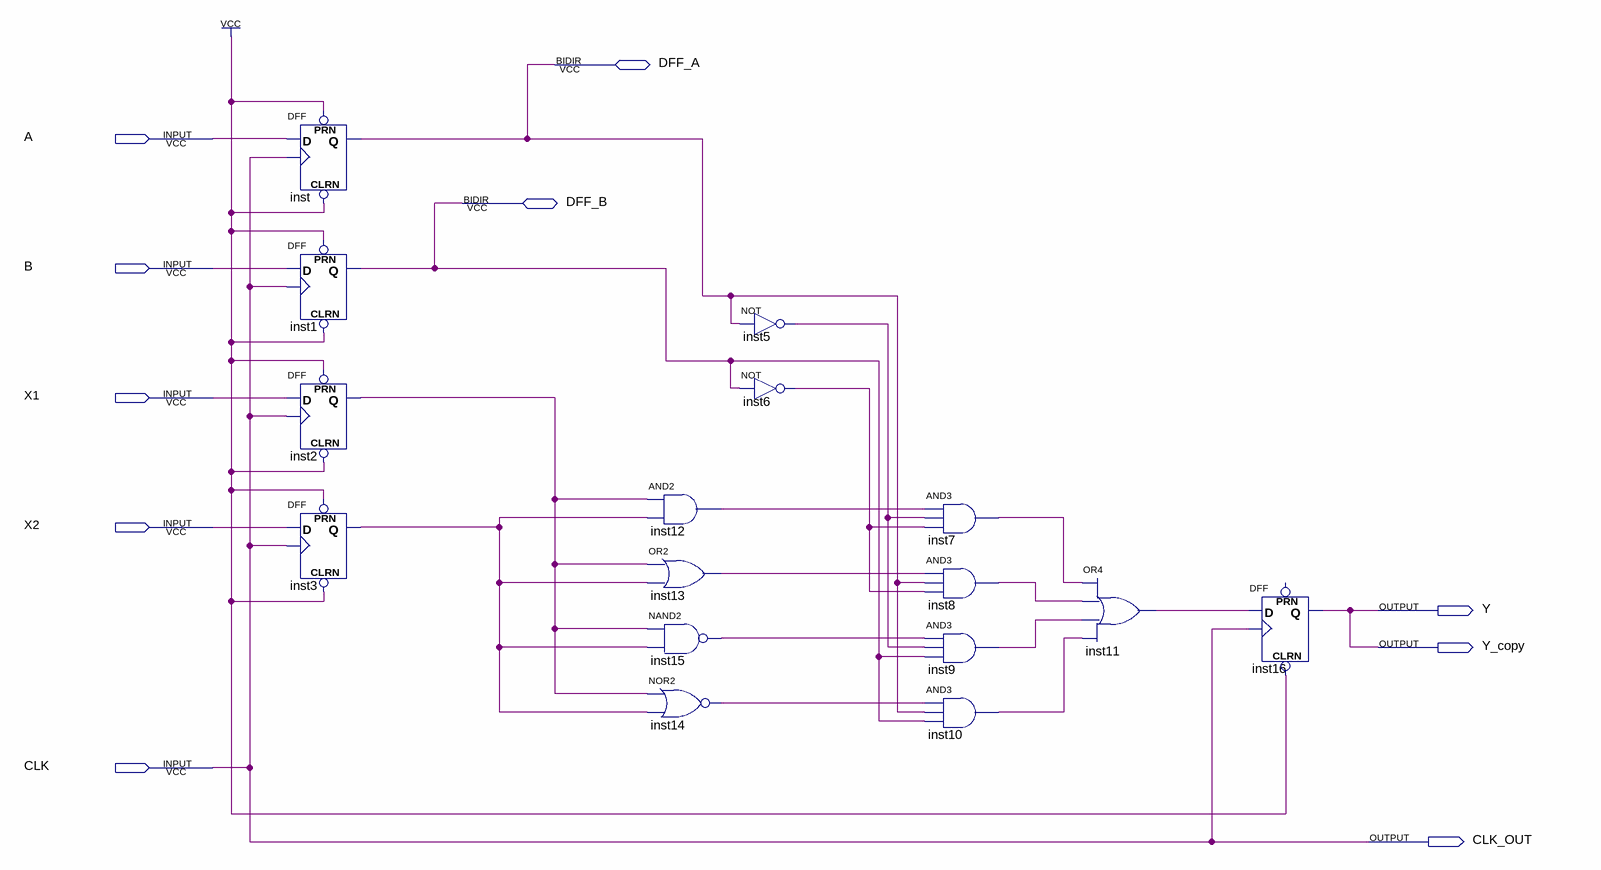
[diagram p0: schematic sheet]
// Quartus schematic fpga_1bit.bdf as structural Verilog: 16 symbols, 10 pins
module fpga_1bit (
  input  A,
  input  B,
  input  X1,
  input  X2,
  input  CLK,
  inout  DFF_A,
  inout  DFF_B,
  output Y,
  output Y_copy,
  output CLK_OUT
);

  wire inst2_q, inst3_q, inst5_out, inst6_out, inst7_out, inst8_out, inst9_out, inst10_out, inst11_out,
       inst12_out, inst13_out, inst14_out, inst15_out;

  DFF inst (.CLRN(1'b1), .CLK(CLK), .D(A), .PRN(1'b1), .Q(DFF_A));
  DFF inst1 (.CLRN(1'b1), .CLK(CLK), .D(B), .PRN(1'b1), .Q(DFF_B));
  DFF inst2 (.CLRN(1'b1), .CLK(CLK), .D(X1), .PRN(1'b1), .Q(inst2_q));
  DFF inst3 (.CLRN(1'b1), .CLK(CLK), .D(X2), .PRN(1'b1), .Q(inst3_q));
  and inst12 (inst12_out, inst2_q, inst3_q);
  or inst13 (inst13_out, inst2_q, inst3_q);
  nand inst15 (inst15_out, inst2_q, inst3_q);
  nor inst14 (inst14_out, inst2_q, inst3_q);
  not inst5 (inst5_out, DFF_A);
  not inst6 (inst6_out, DFF_B);
  and inst7 (inst7_out, inst12_out, inst5_out, inst6_out);
  and inst8 (inst8_out, inst13_out, DFF_A, inst6_out);
  and inst9 (inst9_out, inst15_out, inst5_out, DFF_B);
  and inst10 (inst10_out, inst14_out, DFF_A, DFF_B);
  or inst11 (inst11_out, inst7_out, inst8_out, inst9_out, inst10_out);
  DFF inst16 (.CLRN(1'b1), .CLK(CLK), .D(inst11_out), .Q(Y));  // open: PRN

  assign CLK_OUT = CLK;
  assign Y_copy = Y;
endmodule
